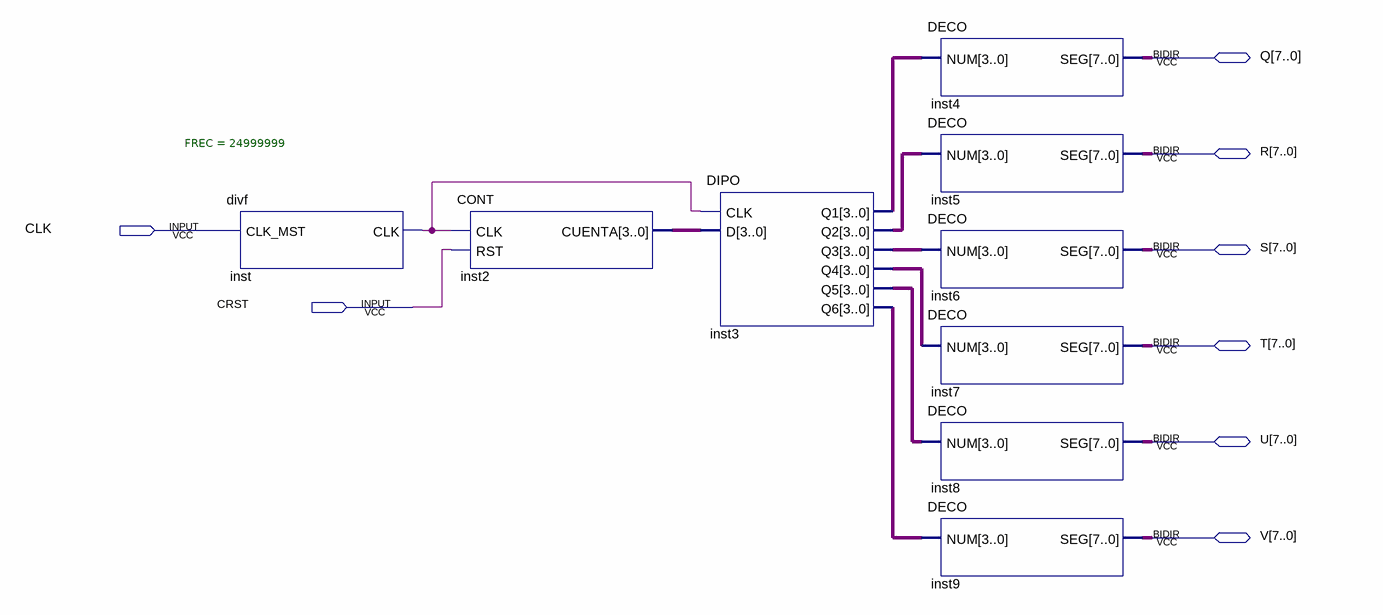
[diagram p0: schematic sheet]
// Quartus schematic practica05.bdf as structural Verilog: 9 symbols, 8 pins
module practica05 (
  input  CLK,
  input  CRST,
  inout  [7:0] Q,
  inout  [7:0] R,
  inout  [7:0] S,
  inout  [7:0] T,
  inout  [7:0] U,
  inout  [7:0] V
);

  wire inst_clk;
  wire [3:0] inst2_cuenta, inst3_q1, inst3_q2, inst3_q3, inst3_q4, inst3_q5, inst3_q6;

  divf #(.FREC(24999999)) inst (.CLK_MST(CLK), .CLK(inst_clk));
  CONT inst2 (.CLK(inst_clk), .RST(CRST), .CUENTA(inst2_cuenta));
  DIPO inst3 (
    .CLK(inst_clk), .D(inst2_cuenta), .Q1(inst3_q1), .Q2(inst3_q2), .Q3(inst3_q3), .Q4(inst3_q4),
    .Q5(inst3_q5), .Q6(inst3_q6));
  DECO inst4 (.NUM(inst3_q1), .SEG(Q));
  DECO inst5 (.NUM(inst3_q2), .SEG(R));
  DECO inst6 (.NUM(inst3_q3), .SEG(S));
  DECO inst7 (.NUM(inst3_q4), .SEG(T));
  DECO inst8 (.NUM(inst3_q5), .SEG(U));
  DECO inst9 (.NUM(inst3_q6), .SEG(V));
endmodule
